# Altium schematic sheet connectors.SchDoc: Science Board Connectors
size A4; DrawnBy: Adrianna Ascalon
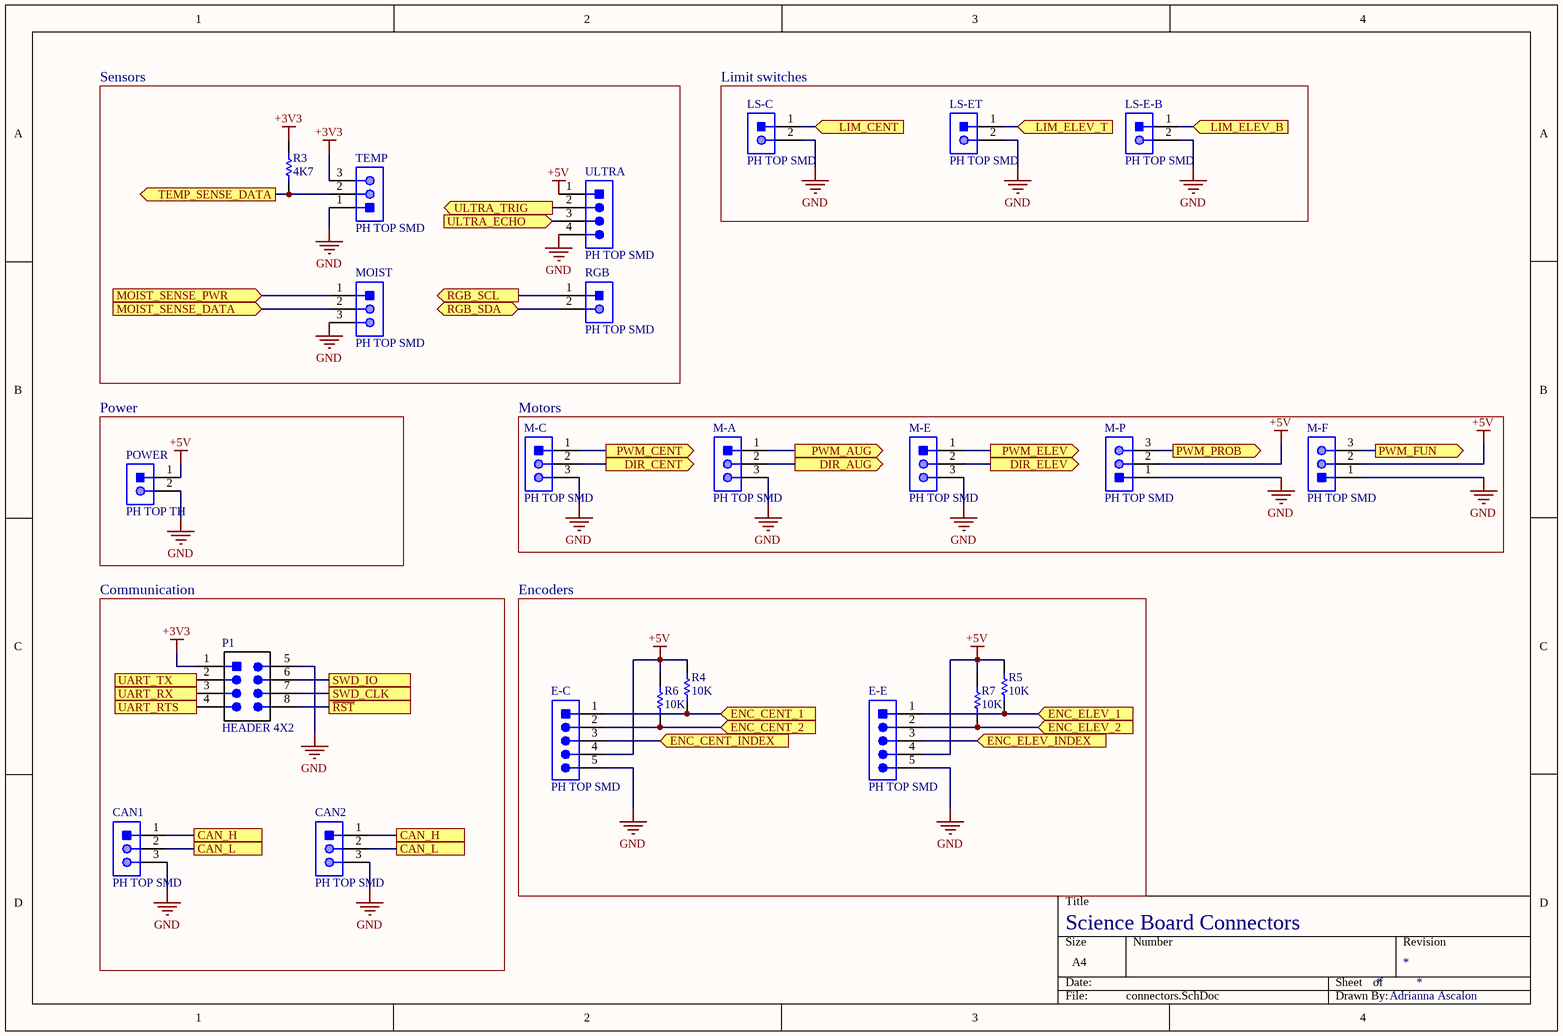
[diagram p0: connectors.SchDoc]

## Parts
CAN1  PH TOP SMD  [JST-B3B-SM4-TB]
CAN2  PH TOP SMD  [JST-B3B-SM4-TB]
E-C  PH TOP SMD  [JST-B5B-SM4-TB]
E-E  PH TOP SMD  [JST-B5B-SM4-TB]
LS-C  PH TOP SMD  [JST-B2B-SM4-TB]
LS-E-B  PH TOP SMD  [JST-B2B-SM4-TB]
LS-ET  PH TOP SMD  [JST-B2B-SM4-TB]
M-A  PH TOP SMD  [JST-B3B-SM4-TB]
M-C  PH TOP SMD  [JST-B3B-SM4-TB]
M-E  PH TOP SMD  [JST-B3B-SM4-TB]
M-F  PH TOP SMD  [JST-B3B-SM4-TB]
M-P  PH TOP SMD  [JST-B3B-SM4-TB]
MOIST  PH TOP SMD  [JST-B3B-SM4-TB]
P1  HEADER 4X2  [HEADER_2X4]
POWER  PH TOP TH  [JST-B2B-PHSK]
R3  value 4K7  [RESC0603(1608)_N]  (hidden comment: RES_4K7_0603)
R4  value 10K  [RESC0603(1608)_N]  (hidden comment: RES_10K_0603)
R5  value 10K  [RESC0603(1608)_N]  (hidden comment: RES_10K_0603)
R6  value 10K  [RESC0603(1608)_N]  (hidden comment: RES_10K_0603)
R7  value 10K  [RESC0603(1608)_N]  (hidden comment: RES_10K_0603)
RGB  PH TOP SMD  [JST-B2B-SM4-TB]
TEMP  PH TOP SMD  [JST-B3B-SM4-TB]
ULTRA  PH TOP SMD  [JST-B4B-SM4-TB]

## Blocks framed on the sheet
Sensors: MOIST R3 RGB TEMP ULTRA
Limit switches: LS-C LS-E-B LS-ET
Power: POWER
Motors: M-A M-C M-E M-F M-P
Communication: CAN1 CAN2 P1
Encoders: E-C E-E R4-R7

## Ports
CAN_H, CAN_L, DIR_AUG (out), DIR_CENT (out), DIR_ELEV (out), ENC_CENT_1 (in), ENC_CENT_2 (in), ENC_CENT_INDEX (in), ENC_ELEV_1 (in), ENC_ELEV_2 (in), ENC_ELEV_INDEX (in), LIM_CENT (in), LIM_ELEV_B (in), LIM_ELEV_T (in), MOIST_SENSE_DATA (in), MOIST_SENSE_PWR (in), PWM_AUG (out), PWM_CENT (out), PWM_ELEV (out), PWM_FUN (out), PWM_PROB (out), RGB_SCL (out), RGB_SDA (bidir), SWD_CLK, SWD_IO, TEMP_SENSE_DATA (out), UART_RTS, UART_RX (in), UART_TX (out), ULTRA_ECHO (in), ULTRA_TRIG (out), ~{RST}

## Nets
+3V3: P1.1(VCC) R3.2 TEMP.3
+5V: E-C.4 E-E.4 M-F.2 M-P.2 POWER.1 R4.2 R5.2 R6.2 R7.2 ULTRA.1
GND: CAN1.3 CAN2.3 E-C.5 E-E.5 LS-C.2 LS-E-B.2 LS-ET.2 M-A.3 M-C.3 M-E.3 M-F.1 M-P.1 MOIST.3 P1.5(GND) POWER.2 TEMP.1 ULTRA.4
~{RST}: P1.8 ; port ~{RST}
CAN_H: CAN1.1 CAN2.1 ; port CAN_H
CAN_L: CAN1.2 CAN2.2 ; port CAN_L
DIR_AUG: M-A.2 ; port DIR_AUG
DIR_CENT: M-C.2 ; port DIR_CENT
DIR_ELEV: M-E.2 ; port DIR_ELEV
ENC_CENT_1: E-C.1 R4.1 ; port ENC_CENT_1
ENC_CENT_2: E-C.2 R6.1 ; port ENC_CENT_2
ENC_CENT_INDEX: E-C.3 ; port ENC_CENT_INDEX
ENC_ELEV_1: E-E.1 R5.1 ; port ENC_ELEV_1
ENC_ELEV_2: E-E.2 R7.1 ; port ENC_ELEV_2
ENC_ELEV_INDEX: E-E.3 ; port ENC_ELEV_INDEX
LIM_CENT: LS-C.1 ; port LIM_CENT
LIM_ELEV_B: LS-E-B.1 ; port LIM_ELEV_B
LIM_ELEV_T: LS-ET.1 ; port LIM_ELEV_T
MOIST_SENSE_DATA: MOIST.2 ; port MOIST_SENSE_DATA
MOIST_SENSE_PWR: MOIST.1 ; port MOIST_SENSE_PWR
PWM_AUG: M-A.1 ; port PWM_AUG
PWM_CENT: M-C.1 ; port PWM_CENT
PWM_ELEV: M-E.1 ; port PWM_ELEV
PWM_FUN: M-F.3 ; port PWM_FUN
PWM_PROB: M-P.3 ; port PWM_PROB
RGB_SCL: RGB.1 ; port RGB_SCL
RGB_SDA: RGB.2 ; port RGB_SDA
SWD_CLK: P1.7 ; port SWD_CLK
SWD_IO: P1.6 ; port SWD_IO
TEMP_SENSE_DATA: R3.1 TEMP.2 ; port TEMP_SENSE_DATA
UART_RTS: P1.4 ; port UART_RTS
UART_RX: P1.3 ; port UART_RX
UART_TX: P1.2 ; port UART_TX
ULTRA_ECHO: ULTRA.3 ; port ULTRA_ECHO
ULTRA_TRIG: ULTRA.2 ; port ULTRA_TRIG

## Library data of the parts
CAN1 CAN2 M-A M-C M-E M-F M-P MOIST TEMP = CON_3M_PH_TOP_SMT: CONN HEADER PH TOP 3POS 2MM SMD; Manufacturer: JST; Part Number: B3B-PH-SM4-TB; ComponentLink1Description: Datasheet; ComponentLink1URL: http://www.jst-mfg.com/product/pdf/eng/ePH.pdf
E-C E-E = CON_5M_PH_TOP_SMT: CONN HEADER PH TOP 5POS 2MM SMD; Manufacturer: JST; Part Number: B5B-PH-SM4-TB; ComponentLink1Description: Datasheet; ComponentLink1URL: http://www.jst-mfg.com/product/pdf/eng/ePH.pdf
LS-C LS-E-B LS-ET RGB = CON_2M_PH_TOP_SMT: CONN HEADER PH TOP 2POS 2MM SMD; Manufacturer: JST; Part Number: B2B-PH-SM4-TB; ComponentLink1Description: Datasheet; ComponentLink1URL: http://www.jst-mfg.com/product/pdf/eng/ePH.pdf
P1 = HEADER 4X2: Header, 4-Pin Dual row; MPN: GRPB042VWVN-RC; Manufacturer: Sullins Connector Solutions; Digikey Part Number: S9015E-04-ND
POWER = CON_2M_PH_TOP_TH: CONN HEADER PH TOP 2POS 2MM; Manufacturer: JST; Part Number: B2B-PH-K-S; ComponentLink1Description: Datasheet; ComponentLink1URL: http://www.jst-mfg.com/product/pdf/eng/ePH.pdf
R3 = RES_4K7_0603: RES SMD 4.7K OHM 5% 1/10W 0603; Manufacturer: Yageo; MPN: RC0603JR-074K7L; Package: 0603 (1608 Metric); Dimensions: 0.063" L x 0.031" W (1.60mm x 0.80mm); Tolerance: 5%; Digikey Part Number: 311-4.7KGRCT-ND
R4-R7 = RES_10K_0603: RES SMD 10K OHM 5% 1/10W 0603; Manufacturer: Yageo; MPN: RC0603JR-0710KL; Package: 0603 (1608 Metric); Dimensions: 0.063" L x 0.031" W (1.60mm x 0.80mm); Tolerance: 5%; Digikey Part Number: 311-10KGRCT-ND
ULTRA = CON_4M_PH_TOP_SMT: CONN HEADER PH TOP 4POS 2MM SMD; Manufacturer: JST; Part Number: B4B-PH-SM4-TB; ComponentLink1Description: Datasheet; ComponentLink1URL: http://www.jst-mfg.com/product/pdf/eng/ePH.pdf